# Altium schematic sheet Master.SchDoc
size A; SheetNumber: 1; SheetTotal: 3
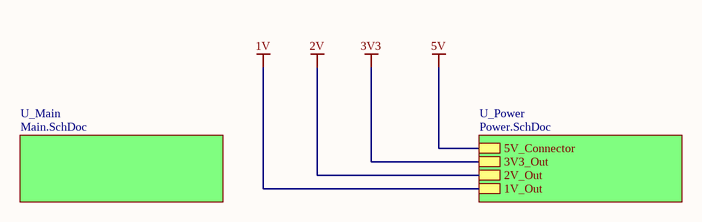
[diagram p0: Master.SchDoc]

## Sub-sheets
U_Main = Main.SchDoc: no entries
U_Power = Power.SchDoc: 5V_Connector, 3V3_Out, 2V_Out, 1V_Out

## Nets
1V: sheet U_Power/1V_Out
2V: sheet U_Power/2V_Out
3V3: sheet U_Power/3V3_Out
5V: sheet U_Power/5V_Connector